# Altium schematic sheet Serializer_System.SchDoc
size A
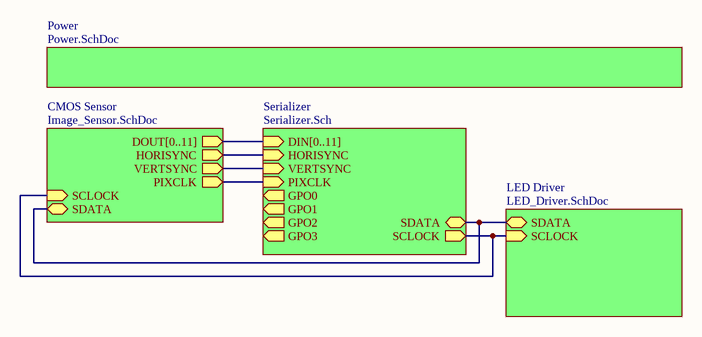
[diagram p0: Serializer_System.SchDoc]

## Sub-sheets
CMOS Sensor = Image_Sensor.SchDoc: HORISYNC (out), VERTSYNC (out), PIXCLK (out), SCLOCK (in), SDATA (bidir), DOUT[0..11] (out)
LED Driver = LED_Driver.SchDoc: SCLOCK (in), SDATA (bidir)
Power = Power.SchDoc: no entries
Serializer = Serializer.Sch: HORISYNC (in), VERTSYNC (in), PIXCLK (in), SDATA (bidir), SCLOCK (out), GPO0 (out), GPO1 (out), GPO2 (out), GPO3 (out), DIN[0..11] (in)

## Nets
(unnamed): sheet Serializer/HORISYNC, sheet CMOS Sensor/HORISYNC
(unnamed): sheet Serializer/VERTSYNC, sheet CMOS Sensor/VERTSYNC
(unnamed): sheet Serializer/PIXCLK, sheet CMOS Sensor/PIXCLK
(unnamed): sheet Serializer/SDATA, sheet LED Driver/SDATA, sheet CMOS Sensor/SDATA
(unnamed): sheet Serializer/SCLOCK, sheet LED Driver/SCLOCK, sheet CMOS Sensor/SCLOCK

## Buses and harness runs
bus sheet CMOS Sensor/DOUT[0..11] = sheet Serializer/DIN[0..11]